# EAGLE design SolarPanels_Power_Processing (EAGLE 8.5.1)
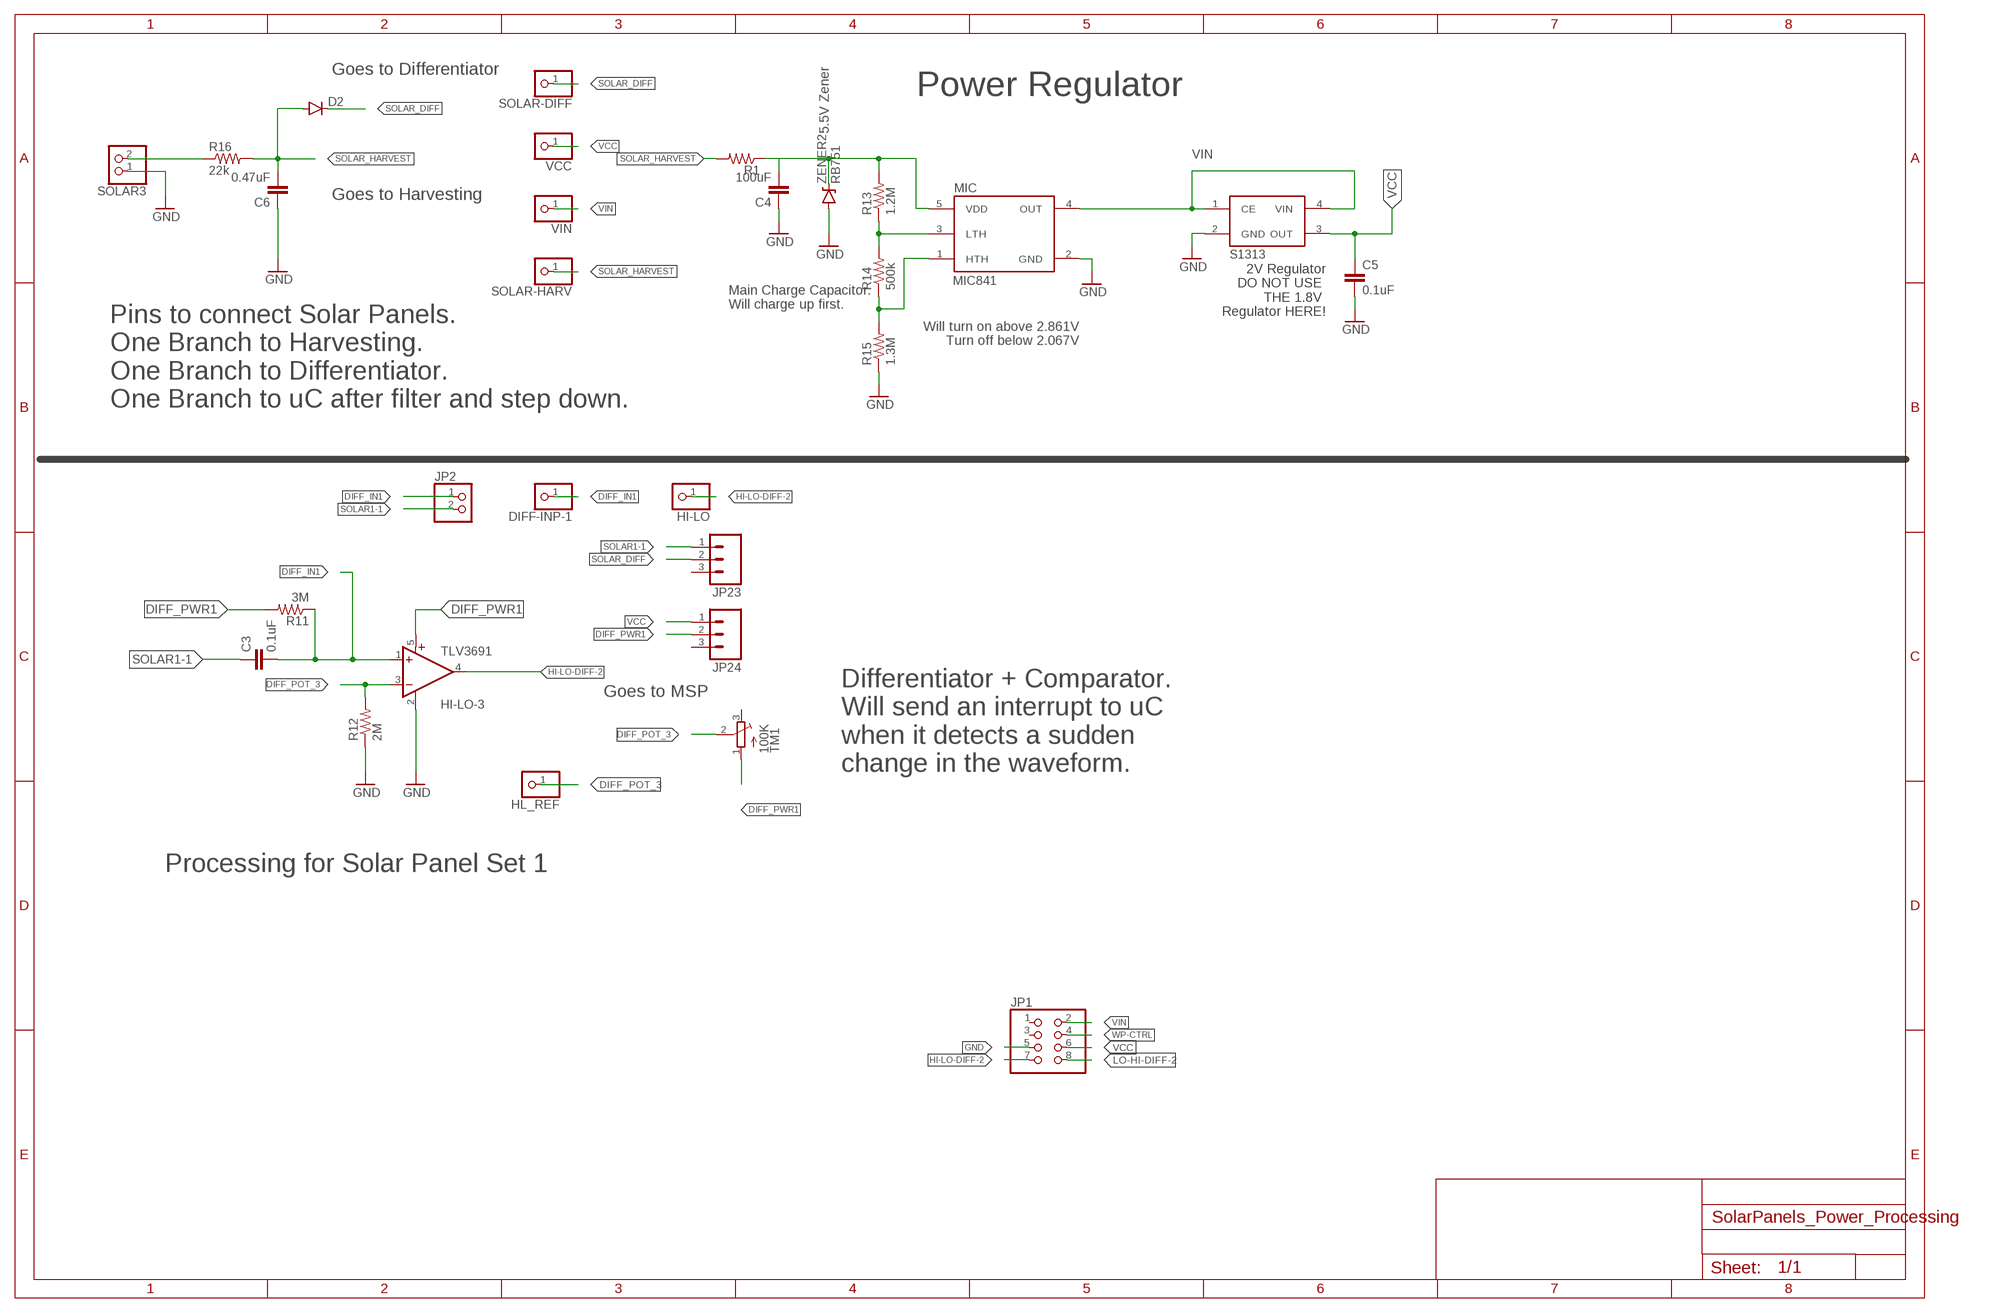
[diagram p0: schematic, sheet 1]

## Parts
C3  0.1uF  CAP0805  [0805]
C4  100uF  CAP0805  [0805]
C5  0.1uF  CAP0805  [0805]
C6  0.47uF  CAP0805  [0805]
D2  DIODESOD523  [SOD523]
DIFF-INP-1  PINHD-1X1  [1X01]
HI-LO  PINHD-1X1  [1X01]
HI-LO-3  TLV3691  [SC70-5]
HL_REF  PINHD-1X1  [1X01]
JP1  PINHD-2X4/90  [2X04/90]
JP2  PINHD-1X2  [1X02]
JP23  M03  [1X03-1.27MM]
JP24  M03  [1X03-1.27MM]
MIC  MIC841  [SC70-5]
NCP  S1313  NCP583  [SC82-AB_1PRIMARY]
R1  RESISTOR0805-RES  [0805]
R11  3M  RESISTOR0805-RES  [0805]
R12  2M  RESISTOR0805-RES  [0805]
R13  1.2M  RESISTOR0805-RES  [0805]
R14  500k  RESISTOR0805-RES  [0805]
R15  1.3M  RESISTOR0805-RES  [0805]
R16  22k  RESISTOR0805-RES  [0805]
SOLAR3  PINHD-1X2  [1X02]
SOLAR-DIFF  PINHD-1X1  [1X01]
SOLAR-HARV  PINHD-1X1  [1X01]
TM1  100K  TRIMPOTTC33X  [TC33X]
VCC  PINHD-1X1  [1X01]
VIN  PINHD-1X1  [1X01]
ZENER2  RB751  DIODE-ZENER  [SOD-523]

## Nets
DIFF_IN1: C3.2 DIFF-INP-1.1 HI-LO-3.1(+IN) JP2.1 R11.1
DIFF_POT_3: HI-LO-3.3(-IN) HL_REF.1 R12.2 TM1.2(S)
DIFF_PWR1: HI-LO-3.5(V+) JP24.2 R11.2 TM1.1(A)
GND: C4.1 C5.2 C6.1 HI-LO-3.2(GND) JP1.5 MIC.2(GND) NCP.2(GND) R12.1 R15.1 SOLAR3.1 ZENER2.ANODE(A)
HI-LO-DIFF-2: HI-LO-3.4(OUT) HI-LO.1 JP1.7
LO-HI-DIFF-2: JP1.8
MIC_INPUT: C4.2 MIC.5(VDD) R1.1 R13.2 ZENER2.CATHODE(C)
N$11: MIC.3(LTH) R13.1 R14.2
N$12: MIC.1(HTH) R14.1 R15.2
SOLAR1: R16.1 SOLAR3.2
SOLAR1-1: C3.1 JP2.2 JP23.1
SOLAR_DIFF: D2.C JP23.2 SOLAR-DIFF.1
SOLAR_HARVEST: C6.2 D2.A R1.2 R16.2 SOLAR-HARV.1
VCC: C5.1 JP1.6 JP24.1 NCP.3(OUT) VCC.1
VIN: JP1.2 MIC.4(OUT) NCP.1(CE) NCP.4(VIN) VIN.1
WP-CTRL: JP1.4
Unconnected: JP1.1 JP1.3 JP23.3 JP24.3 TM1.3(E)

## Notes on the sheet
- Goes to Differentiator
- Power Regulator
- 5.5V Zener
- Goes to Harvesting
- 2V Regulator
  DO NOT USE 
  THE 1.8V 
  Regulator HERE!
- Main Charge Capacitor.
  Will charge up first.
- Will turn on above 2.861V
  Turn off below 2.067V
- Pins to connect Solar Panels.
  One Branch to Harvesting.
  One Branch to Differentiator.
  One Branch to uC after filter and step down.
- Goes to MSP
- Differentiator + Comparator.
  Will send an interrupt to uC 
  when it detects a sudden 
  change in the waveform.
- Processing for Solar Panel Set 1

## Library data of the parts
C3-C6 = SparkFun-Capacitors:CAP: Capacitor Standard 0603 ceramic capacitor, and 0.1" leaded capacitor.
D2 = SparkFun-DiscreteSemi:DIODE: Diode These are standard reverse protection diodes and small signal diodes. SMA package can handle up to about 1A. SOD-323 can handle about 200mA. What the SOD-323 package when ordering, there are some mfgs out there that are 5-pin packages.
DIFF-INP-1 HI-LO HL_REF SOLAR-DIFF SOLAR-HARV VCC VIN = adafruit:PINHD-1X1: Pin header 1x1 for 0.1" spacing With round pins
HI-LO-3 = fedpower:TLV3691: 0.9-V to 6.5-V, Nanopower Comparator Datasheets Analog Signal Chain Guide <http://www.ti.com/lit/pdf/slyb174> TLV3691 <http://www.ti.com/lit/ds/symlink/tlv3691.pdf> Manufacturer Product Page TLV3691IDPFR Specifications <http://www.ti.com/general/docs/suppproductinfo.tsp?distId=10&orderablePartNumber=TLV3691IDPFR> Standard Package <javascript:dlgHelp('Standard%20Packaging%20Help');> 1 Category Integrated Circuits (ICs) </product-search/en/integrated-circuits-ics> Family Linear - Comparators </product-search/en/integrated-circuits-ics/linear-comparators/2556221> Series - Packaging <javascript:dlgHelp('Standard%20Packaging%20Help');> Cut Tape (CT) <javascript:dlgHelp('Cut%20Tape%20Help');> Type General Purpose Number of Elements 1 Output Type Push-Pull Voltage - Supply, Single/Dual (±) 0.9 V ~ 6.5 V, ±0.45 V ~ 3.25 V Voltage - Input Offset (Max) 3mV Current - Input Bias (Max) 100pA Current - Output (Typ) 42mA Current - Quiescent (Max) 150nA CMRR, PSRR (Typ) - Propagation Delay (Max) 35µs Hysteresis - Operating Temperature -40°C ~ 125°C Package / Case 6-XFDFN Mounting Type Surface Mount Supplier Device Package 6-X2SON (1x1) Online Catalog Comparators - 1 element </catalog/en/partgroup/comparators-1-element/3112?mpart=TLV3691IDPFR&vendor=296&WT.z_ref_page_type=PS&WT.z_ref_page_sub_type=PD&WT.z_ref_page_id=PD&WT.z_ref_page_event=DC_Link_Table> Other Names 296-37242-1
JP1 = pinhead:PINHD-2X4: PIN HEADER
JP2 SOLAR3 = pinhead:PINHD-1X2: PIN HEADER
JP23 JP24 = SparkFun-Connectors:M03: Header 3 Standard 3-pin 0.1" header. Use with straight break away headers (SKU : PRT-00116), right angle break away headers (PRT-00553), swiss pins (PRT-00743), machine pins (PRT-00117), and female headers (PRT-00115). Molex polarized connector foot print use with SKU : PRT-08232 with associated crimp pins and housings.
MIC = mic841:MIC841: MIC841:Comparator with reference and adj. hysteresis
NCP = ncp583:NCP583: NCP583 - Ultra-Low Iq 150 mA CMOS LDO Regulator with Enable The NCP583 series of low dropout regulators are designed for portable battery powered applications which require precise output voltage accuracy and low quiescent current. These devices feature an enable function which lowers current consumption significantly and are offered in two small packages; SC−82AB and the SOT−563. A 1.0 mF ceramic capacitor is the recommended value to be used with these devices on the output pin.
R1 R11-R16 = SparkFun-Resistors:RESISTOR: Resistor Basic schematic elements and footprints for 0603, 1206, and PTH resistors.
TM1 = adafruit:TRIMPOT: SMT trimmer potentiometer part number TC33X http://www.ladyada.net/library/eagle
ZENER2 = Parts:DIODE-ZENER: Zener Diode Production Part - 8199 3.4V Zener Voltage

## Board
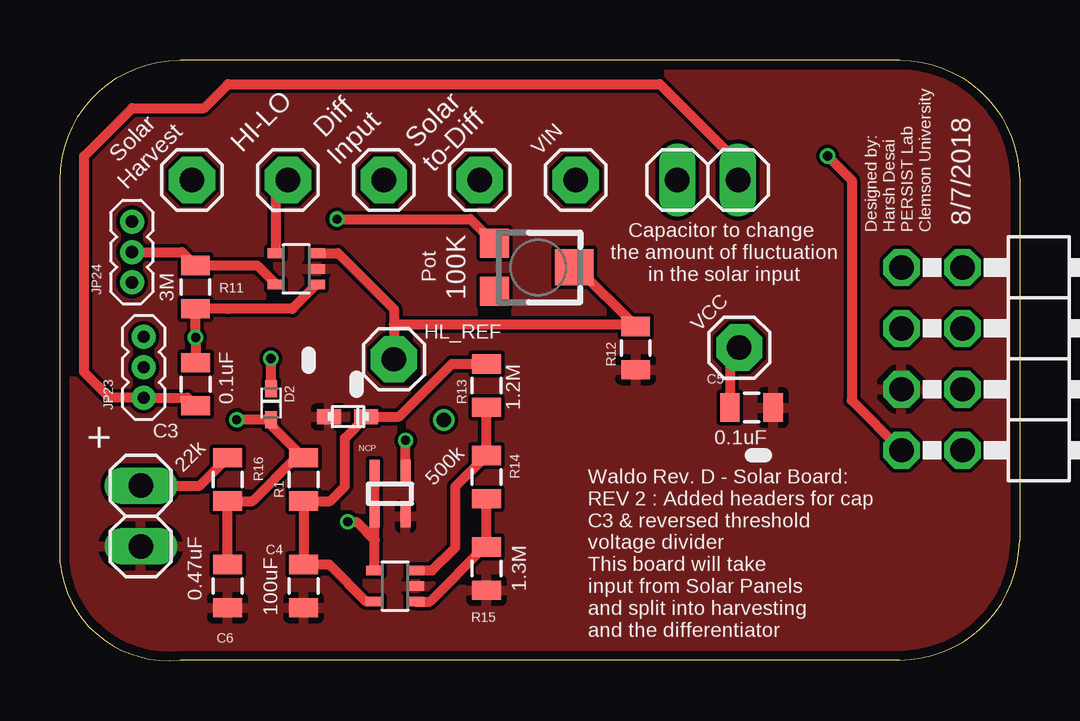
[diagram p1: board, top side]
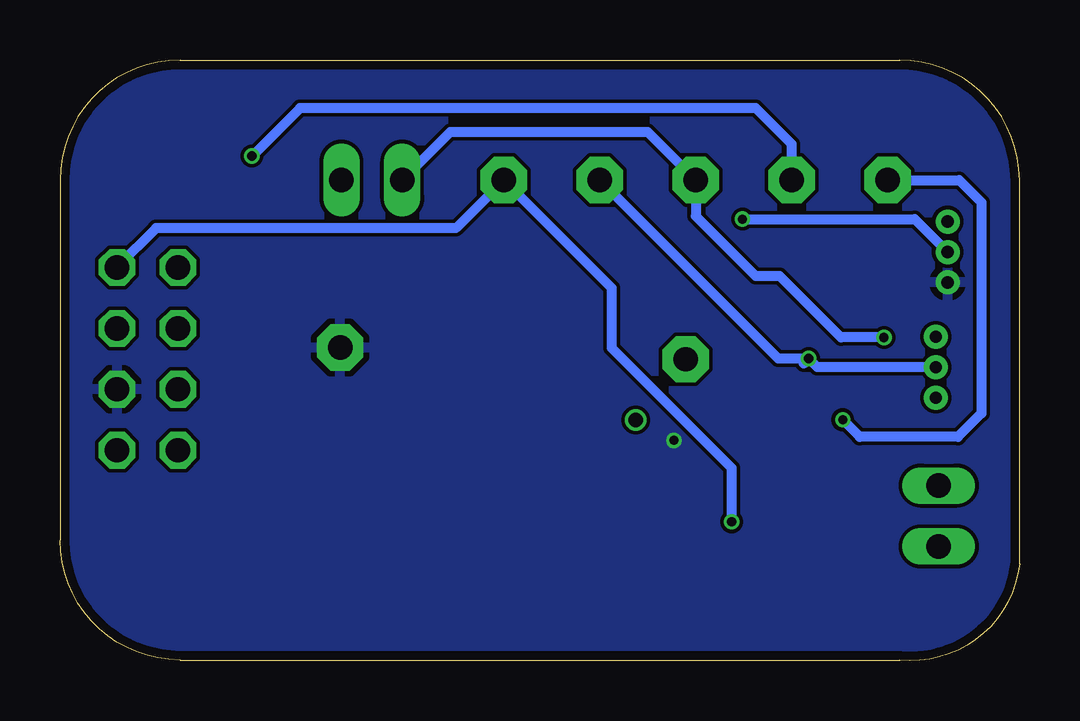
[diagram p2: board, bottom side, seen from below]

Size 40 x 25.03 mm. Coordinates in mm from the lower left corner, seen from the top.
Outline: 35,25.03 5,25.03 arc90 0,20.03 0,4.04 arc90 5,0.03 35,0.03 arc90 40,5.03 40,20.03 arc90 35,25.03
Copper layers (1*16): Top 0.035559375mm / dielectric 1.6mm / Bottom 0.035559375mm
Design rules "oshpark-2layer": minimum track width 6mil, minimum drill 10mil, track to track 6mil, track to pad 6mil, pad to pad 6mil, via to via 6mil, smd to smd 6mil, copper to edge 15mil, drill to drill 6mil, minimum pad ring 5mil, minimum via ring 5mil, stop-mask expansion 2.5mil, vias tented up to drill 0mil, thermal gap 10mil

### Footprints (pad centres in the part's own frame; a part is rotated, then mirrored left to right if it is on the bottom)
0805 = smd 0.8 x 1.2: 1 -0.9,0; 2 0.9,0
SOD523 = smd 0.7 x 0.5: A 0.7,0; C -0.6,0
1X01 = drill 1.016 pad 1.93 octagon: 1 0,0
SC70-5 = smd 0.4 x 0.7: 1 -0.65,-0.85; 2 0,-0.85; 3 0.65,-0.85; 4 0.65,0.85; 5 -0.65,0.85
2X04/90 = drill 1.016 octagon: 1 -3.81,-6.35; 2 -3.81,-3.81; 3 -1.27,-6.35; 4 -1.27,-3.81; 5 1.27,-6.35; 6 1.27,-3.81; 7 3.81,-6.35; 8 3.81,-3.81
1X02 = drill 1.016 long: 1 -1.27,0; 2 1.27,0
1X03-1.27MM = drill 0.508 pad 1: 1 -1.27,0; 2 0,0; 3 1.27,0
SC82-AB_1PRIMARY = smd 0.406 x 0.914: 1 -1.321,-0.813; 2 -0.025,-0.813; 3 -0.025,1.067; 4 -1.321,1.067
TC33X = smd 1.2 x 1.2: 1 -1,-1.825; 3 1,-1.825 | smd 1.5 x 1.6: 2 0,1.5
SOD-523 = smd 1 x 0.635: ANODE -0.8,0; CATHODE 0.76,0

### Placement (x,y rotation side)
C3  5.66,11.52 90 top
C4  10.16,3.11 90 top
C5  28.83,10.55 0 top
C6  6.99,3.11 90 top
D2  8.8,10.73 270 top
DIFF-INP-1  13.5,20.03 0 top
HI-LO  9.5,20.03 0 top
HI-LO-3  9.85,16.33 90 top
HL_REF  13.92,12.56 0 top
JP1  41.43,12.58 270 top
JP2  27,20.03 0 top
JP23  3.49,12.23 90 top
JP24  3,17.03 90 top
MIC  13.97,3.11 90 top
NCP  14.44,6.84 0 top
R1  10.16,7.55 90 top
R11  5.64,15.57 90 top
R12  24,13.03 90 top
R13  17.78,11.46 90 top
R14  17.78,7.65 90 top
R15  17.78,3.84 90 top
R16  6.99,7.55 270 top
SOLAR3  3.37,6.03 90 top
SOLAR-DIFF  17.5,20.03 0 top
SOLAR-HARV  5.5,20.03 0 top
TM1  19.94,16.39 270 top
VCC  28.32,13.05 0 top
VIN  21.5,20.03 0 top
ZENER2  12.01,10.17 0 top

### Tracks (layer width: path | path; a pad name or v marks a point on that pad's centre or on a via)
DIFF_IN1  (via drill 0.38)
  Top 0.406: C3.2 v5.65,13.47 R11.1 5.66,14.66 7,14.66 9.68,14.66 HI-LO-3.1
  Bottom 0.406: v5.65,13.47 7.44,13.47 10,16.03 11,16.03 13.5,18.53 DIFF-INP-1.1 15.5,22.03 23.73,22.03 JP2.1
DIFF_POT_3
  Top 0.406: HI-LO-3.3 11.59,16.98 13.92,14.65 13.92,14.03 | 13.92,14.03 HL_REF.1 | 21,15.95 TM1.2 21.54,16.39 R12.2 23.9,14.03 13.92,14.03
DIFF_PWR1  (via drill 0.38)
  Top 0.406: JP24.2 5.08,17.03 R11.2 8.21,16.47 HI-LO-3.5 | v11.55,18.4 17.11,18.4 TM1.1
  Bottom 0.406: v11.55,18.4 4.37,18.4 JP24.2
GND
  pour Top: -2.54,35.59 -2.54,-2.51 62.23,-2.51 62.23,36.86 -2.54,36.86
HI-LO-DIFF-2  (via drill 0.38)
  Top 0.406: HI-LO-3.4 9,19.53 HI-LO.1 | v32,21.03 33,20.03 33,10.85 JP1.7
  Bottom 0.406: HI-LO.1 9.5,21.53 11,23.03 30,23.03 v32,21.03
MIC_INPUT
  Top 0.406: MIC.5 12.77,2.46 11.22,4.01 C4.2 R1.1 11.26,6.65 11.88,7.28 11.88,9.28 ZENER2.CATHODE 14.14,10.17 16.33,12.36 R13.2
N$1  (via drill 0.6)
  other vias: 16,10.03
N$11
  Top 0.406: R13.1 R14.2 16.47,7.24 16.47,4.71 15.52,3.76 MIC.3
N$12
  Top 0.406: MIC.1 15.42,2.46 17.7,4.74 R15.2 R14.1
SOLAR1
  Top 0.406: SOLAR3.2 5.83,7.3 R16.1
SOLAR1-1
  Top 0.406: C3.1 5.32,10.96 JP23.1 2.07,10.96 1,12.03 1,21.03 3,23.03 6,23.03 7,24.03 25,24.03 28.27,20.76 JP2.2
SOLAR_DIFF  (via drill 0.38)
  Top 0.406: v8.79,12.59 8.79,11.35 D2.C
  Bottom 0.406: JP23.2 8.43,12.23 v8.79,12.59 | v8.79,12.59 10.06,12.59 SOLAR-DIFF.1 | 9,12.38 v8.79,12.59
SOLAR_HARVEST  (via drill 0.38)
  Top 0.406: C6.2 R16.2 8.03,6.65 9.82,8.45 R1.2 8.8,9.81 D2.A v7.38,10.03 v7.37,10.04
  Bottom 0.406: SOLAR-HARV.1 2.52,20.03 1.59,19.1 1.59,10.31 2.57,9.33 6.66,9.33 v7.37,10.04
VCC  (via drill 0.38)
  Top 0.406: NCP.3 v14.41,9.18 | v14.41,9.18 | VCC.1 27.93,12.66 C5.1
  pour Bottom: -5.08,39.4 -5.08,-5.05 64.77,-5.05 64.77,39.4
VIN  (via drill 0.38)
  Top 0.406: 13.12,5.03 NCP.1 | NCP.1 NCP.4 | MIC.4 13.12,5.03 | NCP.1 13.12,6.24 | v12,5.79 12.36,5.79 13.12,5.03
  Bottom 0.406: v12,5.79 12,8.03 17,13.03 17,15.53 VIN.1 23.5,18.03 36,18.03 37.62,16.41 JP1.2

### Text on the board
tPlace: Diff / Input | Solar / to-Diff | Solar / Harvest | Designed by: / Harsh Desai / PERSIST Lab / Clemson University | 8/7/2018 | Pot | Capacitor to change / the amount of fluctuation / in the solar input | + | Waldo Rev. D - Solar Board: / REV 2 : Added headers for cap / C3 & reversed threshold / voltage divider / This board will take / input from Solar Panels / and split into harvesting / and the differentiator